# EAGLE schematic infolight (EAGLE 7.6.0)

## Sheet 1 of 4
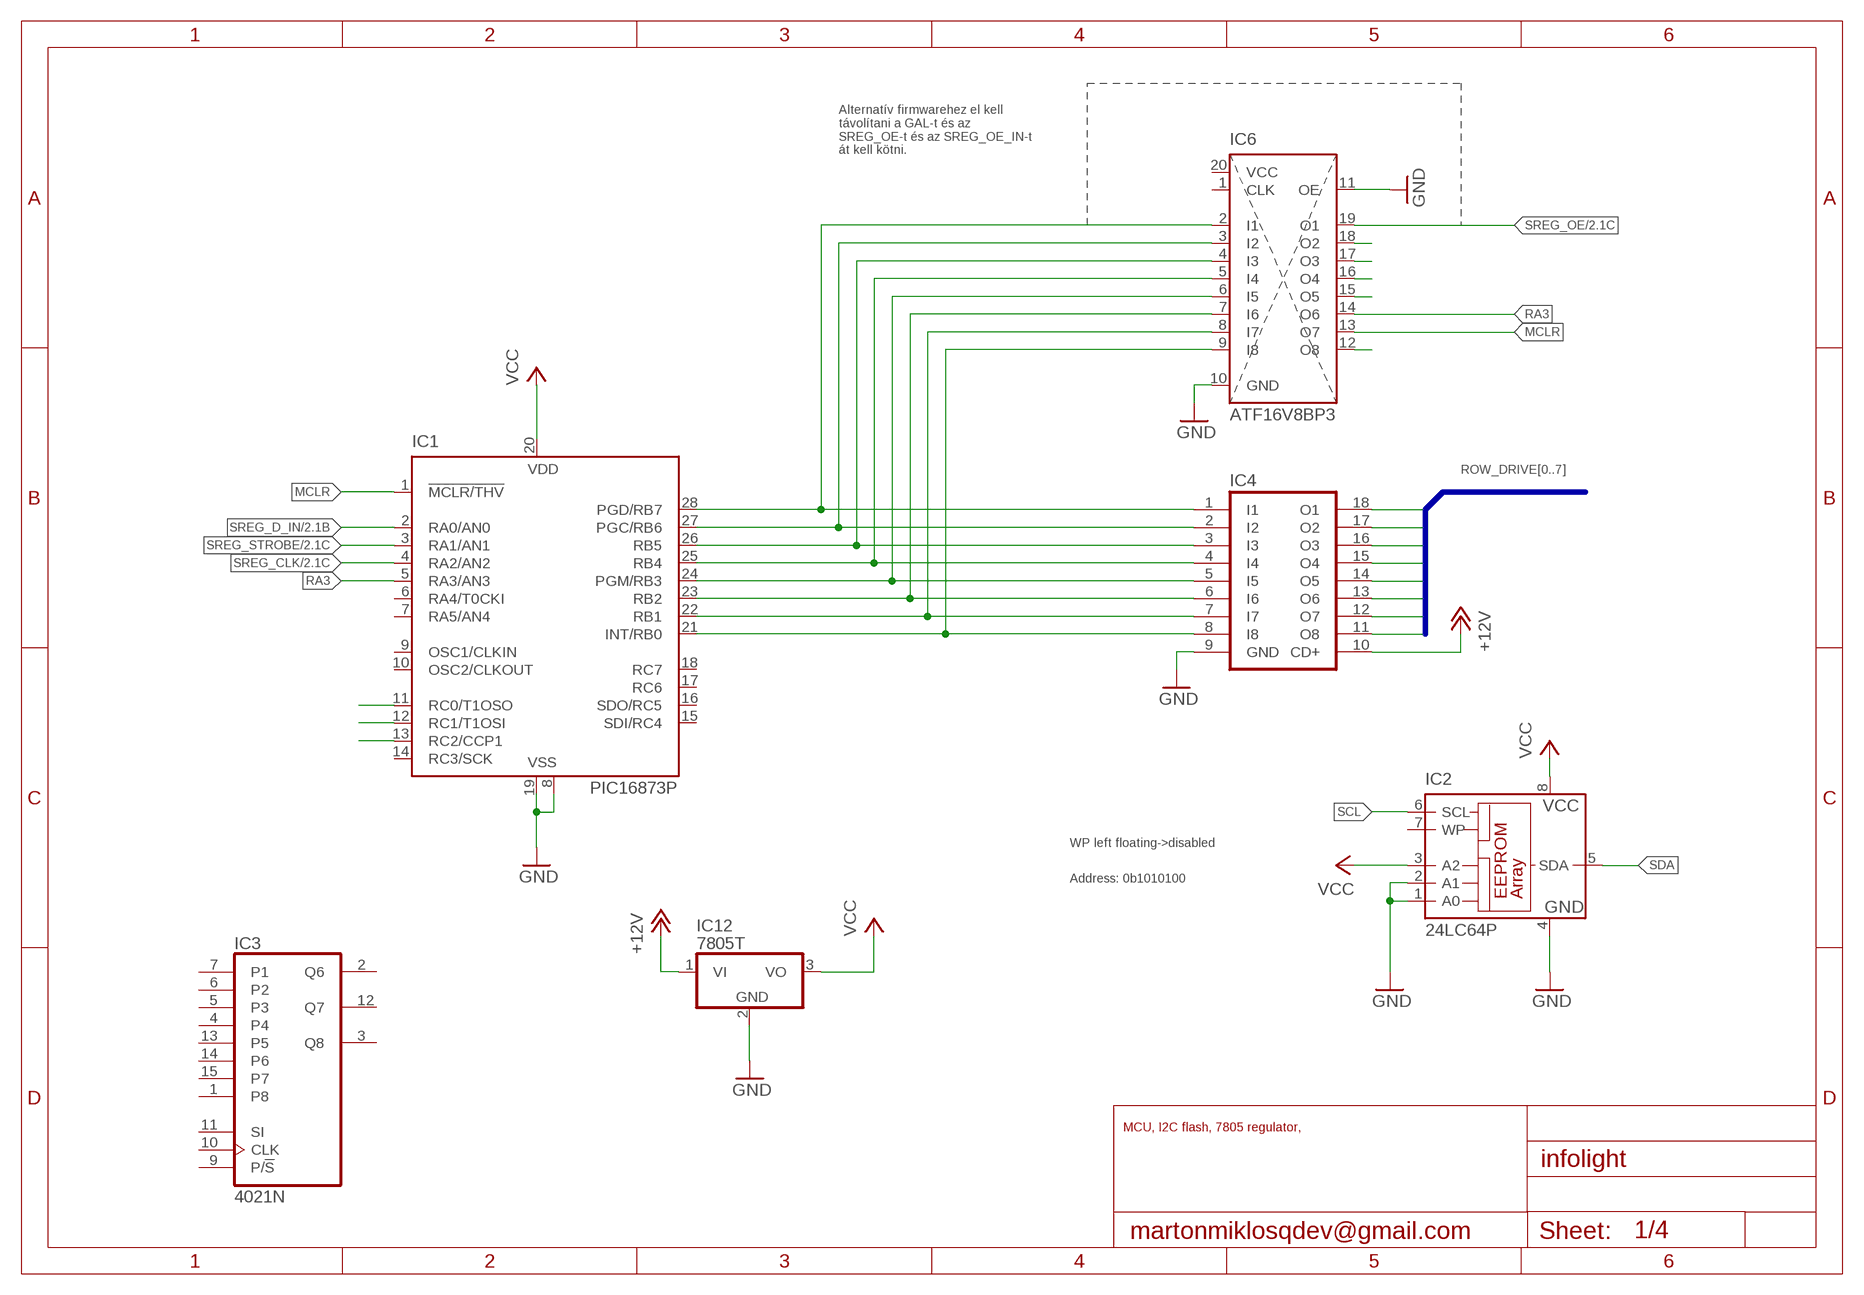
[diagram p0: schematic, sheet 1]

### Parts
IC1  PIC16873P  [DIL28-3]
IC2  24LC64P  [DIL8]
IC3  4021N  [DIL16]
IC4  ULN2804A  [DIL18]
IC6  ATF16V8BP3  [DIL20]
IC12  7805T  [TO220H]

### Nets
+12V: IC4.10(CD+) IC12.1(VI)
GND: IC1.8(VSS) IC1.19(VSS) IC2.1(A0) IC2.2(A1) IC2.4(GND) IC4.9(GND) IC6.10(GND) IC6.11(OE) IC12.2(GND) ; also sheet 2,3
MCLR: IC1.1(!MCLR/THV) IC6.13(O7)
N$18: IC6.18(O2)
N$20: IC1.13(RC2/CCP1)
N$21: IC6.17(O3)
N$22: IC1.27(PGC/RB6) IC4.2(I2) IC6.3(I2)
N$23: IC1.26(RB5) IC4.3(I3) IC6.4(I3)
N$24: IC1.25(RB4) IC4.4(I4) IC6.5(I4)
N$25: IC1.24(PGM/RB3) IC4.5(I5) IC6.6(I5)
N$26: IC1.23(RB2) IC4.6(I6) IC6.7(I6)
N$27: IC1.22(RB1) IC4.7(I7) IC6.8(I7)
N$28: IC1.21(INT/RB0) IC4.8(I8) IC6.9(I8)
N$29: IC6.12(O8)
N$30: IC6.15(O5)
N$32: IC6.16(O4)
N$84: IC1.12(RC1/T1OSI)
N$85: IC1.11(RC0/T1OSO)
RA3: IC1.5(RA3/AN3) IC6.14(O6)
ROW_DR_0: IC1.28(PGD/RB7) IC4.1(I1) IC6.2(I1)
ROW_DRIVE0: IC4.18(O1) ; also sheet 4
ROW_DRIVE1: IC4.17(O2) ; also sheet 4
ROW_DRIVE2: IC4.16(O3) ; also sheet 4
ROW_DRIVE3: IC4.15(O4) ; also sheet 4
ROW_DRIVE4: IC4.14(O5) ; also sheet 4
ROW_DRIVE5: IC4.13(O6) ; also sheet 4
ROW_DRIVE6: IC4.12(O7) ; also sheet 4
ROW_DRIVE7: IC4.11(O8) ; also sheet 4
SCL: IC2.6(SCL)
SDA: IC2.5(SDA)
SREG_CLK: IC1.4(RA2/AN2) ; also sheet 2,3
SREG_D_IN: IC1.2(RA0/AN0) ; also sheet 2
SREG_OE: IC6.19(O1) ; also sheet 2,3
SREG_STROBE: IC1.3(RA1/AN1) ; also sheet 2,3
VCC: IC1.20(VDD) IC2.3(A2) IC2.8(VCC) IC12.3(VO)
Unconnected: IC1.6(RA4/T0CKI) IC1.7(RA5/AN4) IC1.9(OSC1/CLKIN) IC1.10(OSC2/CLKOUT) IC1.14(RC3/SCK) IC1.15(SDI/RC4) IC1.16(SDO/RC5) IC1.17(RC6) IC1.18(RC7) IC2.7(WP) IC3.1(P8) IC3.2(Q6) IC3.3(Q8) IC3.4 IC3.5(P3) IC3.6(P2) IC3.7(P1) IC3.9(P/!S) IC3.10(CLK) IC3.11(SI) IC3.12(Q7) IC3.13(P5) IC3.14(P6) IC3.15(P7) IC6.1(CLK)

### Buses
ROW_DRIVE[0..7]

### Notes on the sheet
- Alternatív firmwarehez el kell
  távolítani a GAL-t és az 
  SREG_OE-t és az SREG_OE_IN-t
  át kell kötni.
- WP left floating->disabled
- Address: 0b1010100
- MCU, I2C flash, 7805 regulator,

## Sheet 2 of 4
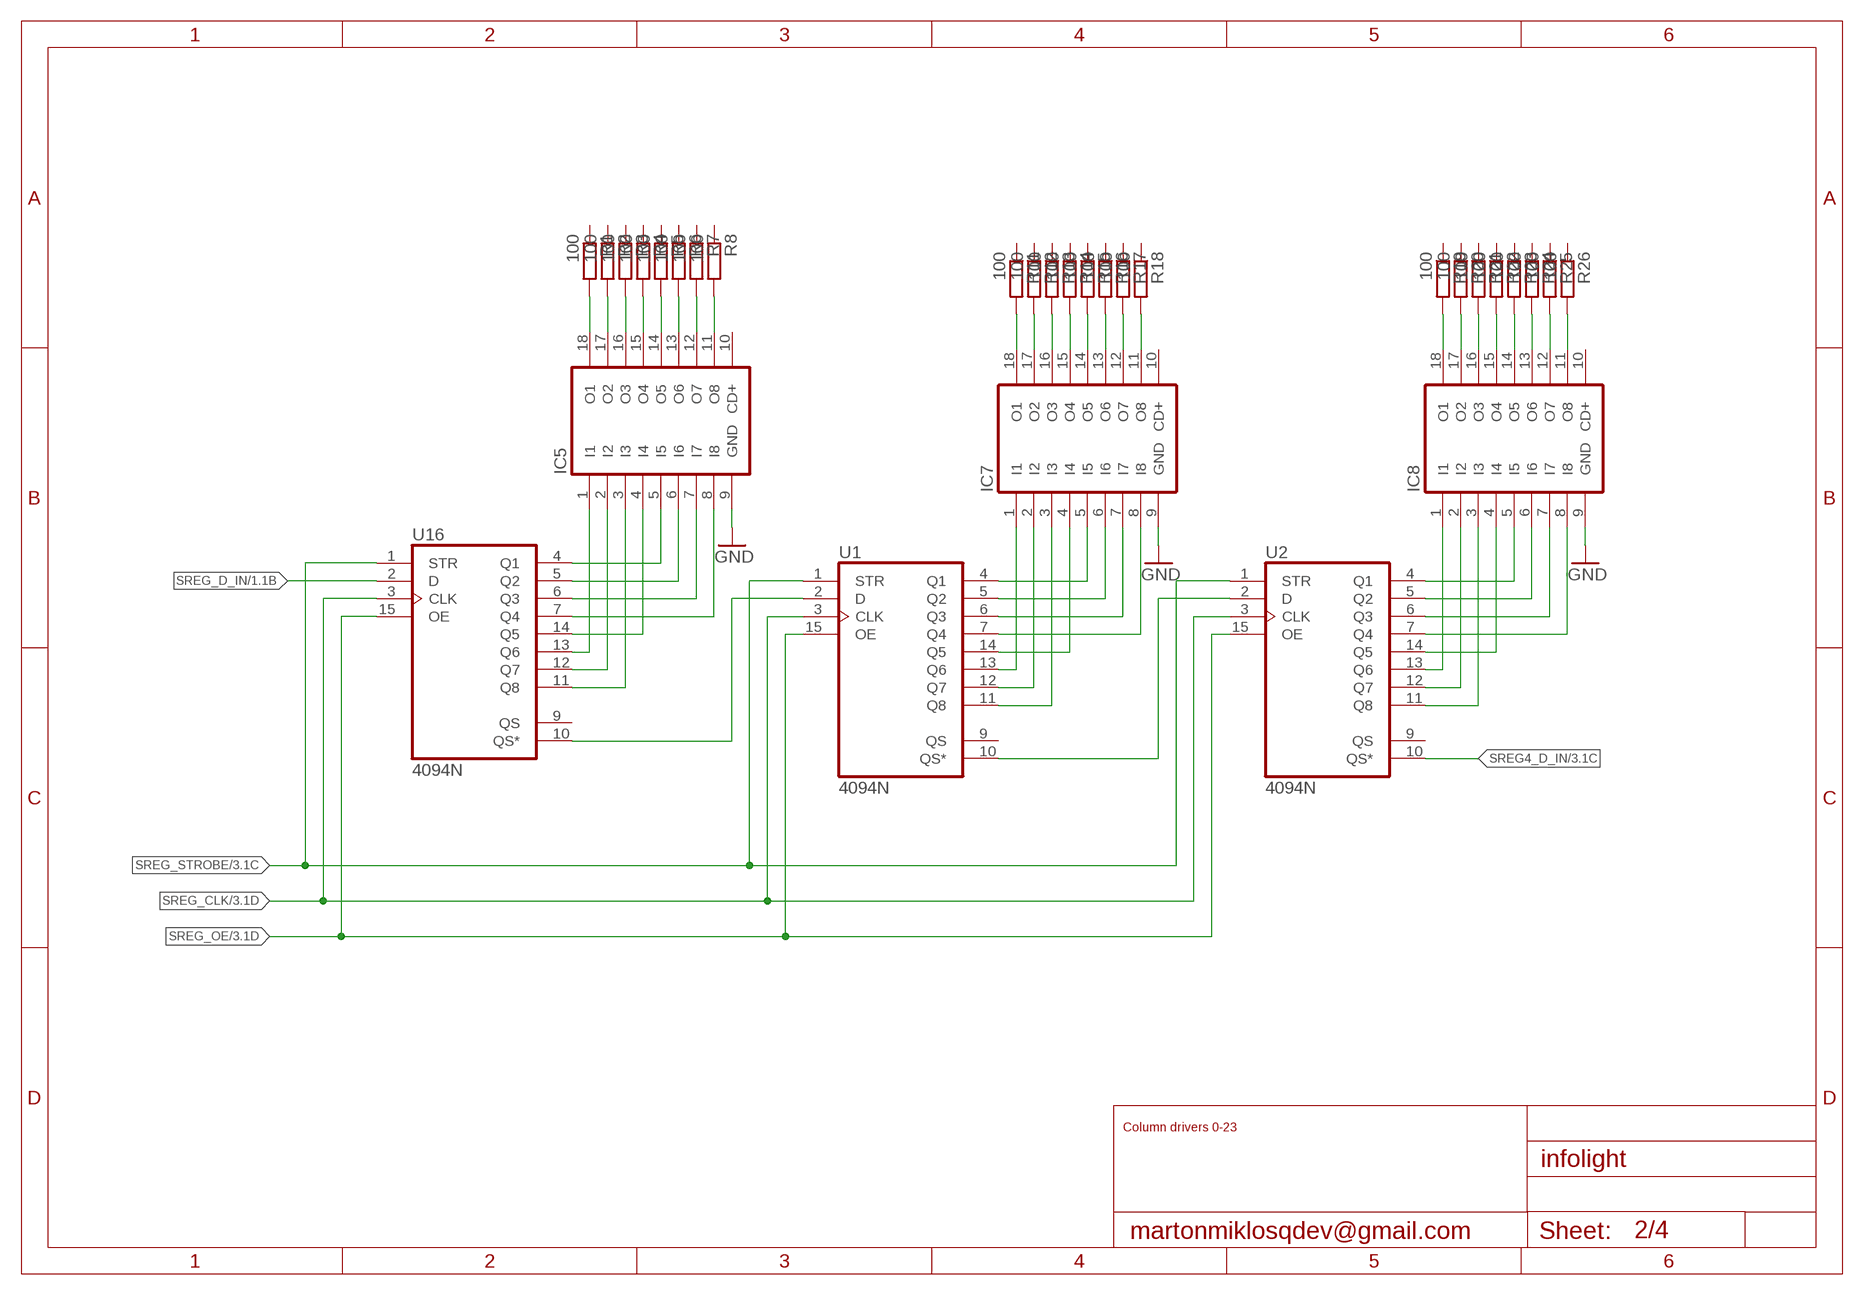
[diagram p1: schematic, sheet 2]

### Parts
IC5  ULN2804A  [DIL18]
IC7  ULN2804A  [DIL18]
IC8  ULN2804A  [DIL18]
R1  100  R-EU_0207/7  [0207/7]
R2  100  R-EU_0207/7  [0207/7]
R3  100  R-EU_0207/7  [0207/7]
R4  100  R-EU_0207/7  [0207/7]
R5  100  R-EU_0207/7  [0207/7]
R6  100  R-EU_0207/7  [0207/7]
R7  100  R-EU_0207/7  [0207/7]
R8  100  R-EU_0207/7  [0207/7]
R11  100  R-EU_0207/7  [0207/7]
R12  100  R-EU_0207/7  [0207/7]
R13  100  R-EU_0207/7  [0207/7]
R14  100  R-EU_0207/7  [0207/7]
R15  100  R-EU_0207/7  [0207/7]
R16  100  R-EU_0207/7  [0207/7]
R17  100  R-EU_0207/7  [0207/7]
R18  100  R-EU_0207/7  [0207/7]
R19  100  R-EU_0207/7  [0207/7]
R20  100  R-EU_0207/7  [0207/7]
R21  100  R-EU_0207/7  [0207/7]
R22  100  R-EU_0207/7  [0207/7]
R23  100  R-EU_0207/7  [0207/7]
R24  100  R-EU_0207/7  [0207/7]
R25  100  R-EU_0207/7  [0207/7]
R26  100  R-EU_0207/7  [0207/7]
U1  4094N  [DIL16]
U2  4094N  [DIL16]
U16  4094N  [DIL16]

### Nets
GND: IC5.9(GND) IC7.9(GND) IC8.9(GND) ; also sheet 1,3
N$1: IC5.5(I5) U16.4(Q1)
N$2: IC5.6(I6) U16.5(Q2)
N$3: IC5.7(I7) U16.6(Q3)
N$4: IC5.8(I8) U16.7(Q4)
N$5: IC5.4(I4) U16.14(Q5)
N$6: IC5.1(I1) U16.13(Q6)
N$7: IC5.3(I3) U16.11(Q8)
N$8: IC5.2(I2) U16.12(Q7)
N$9: IC5.18(O1) R1.2
N$10: IC5.17(O2) R2.2
N$11: IC5.16(O3) R3.2
N$12: IC5.15(O4) R4.2
N$13: IC5.14(O5) R5.2
N$14: IC5.13(O6) R6.2
N$15: IC5.12(O7) R7.2
N$16: IC5.11(O8) R8.2
N$31: IC7.5(I5) U1.4(Q1)
N$33: IC7.6(I6) U1.5(Q2)
N$34: IC7.7(I7) U1.6(Q3)
N$35: IC7.8(I8) U1.7(Q4)
N$36: IC7.4(I4) U1.14(Q5)
N$37: IC7.1(I1) U1.13(Q6)
N$38: IC7.3(I3) U1.11(Q8)
N$39: IC7.2(I2) U1.12(Q7)
N$40: IC7.18(O1) R11.2
N$41: IC7.17(O2) R12.2
N$42: IC7.16(O3) R13.2
N$43: IC7.15(O4) R14.2
N$44: IC7.14(O5) R15.2
N$45: IC7.13(O6) R16.2
N$46: IC7.12(O7) R17.2
N$47: IC7.11(O8) R18.2
N$48: U1.2(D)
N$49: U16.10(QS*)
N$50: IC8.5(I5) U2.4(Q1)
N$51: IC8.6(I6) U2.5(Q2)
N$52: IC8.7(I7) U2.6(Q3)
N$53: IC8.8(I8) U2.7(Q4)
N$54: IC8.4(I4) U2.14(Q5)
N$55: IC8.1(I1) U2.13(Q6)
N$56: IC8.3(I3) U2.11(Q8)
N$57: IC8.2(I2) U2.12(Q7)
N$58: IC8.18(O1) R19.2
N$59: IC8.17(O2) R20.2
N$60: IC8.16(O3) R21.2
N$61: IC8.15(O4) R22.2
N$62: IC8.14(O5) R23.2
N$63: IC8.13(O6) R24.2
N$64: IC8.12(O7) R25.2
N$65: IC8.11(O8) R26.2
N$66: U2.2(D)
N$67: U1.10(QS*)
SREG4_D_IN: U2.10(QS*) ; also sheet 3
SREG_CLK: U1.3(CLK) U2.3(CLK) U16.3(CLK) ; also sheet 1,3
SREG_D_IN: U16.2(D) ; also sheet 1
SREG_OE: U1.15(OE) U2.15(OE) U16.15(OE) ; also sheet 1,3
SREG_STROBE: U1.1(STR) U2.1(STR) U16.1(STR) ; also sheet 1,3
Unconnected: IC5.10(CD+) IC7.10(CD+) IC8.10(CD+) R1.1 R2.1 R3.1 R4.1 R5.1 R6.1 R7.1 R8.1 R11.1 R12.1 R13.1 R14.1 R15.1 R16.1 R17.1 R18.1 R19.1 R20.1 R21.1 R22.1 R23.1 R24.1 R25.1 R26.1 U1.9(QS) U2.9(QS) U16.9(QS)

### Notes on the sheet
- Column drivers 0-23

## Sheet 3 of 4
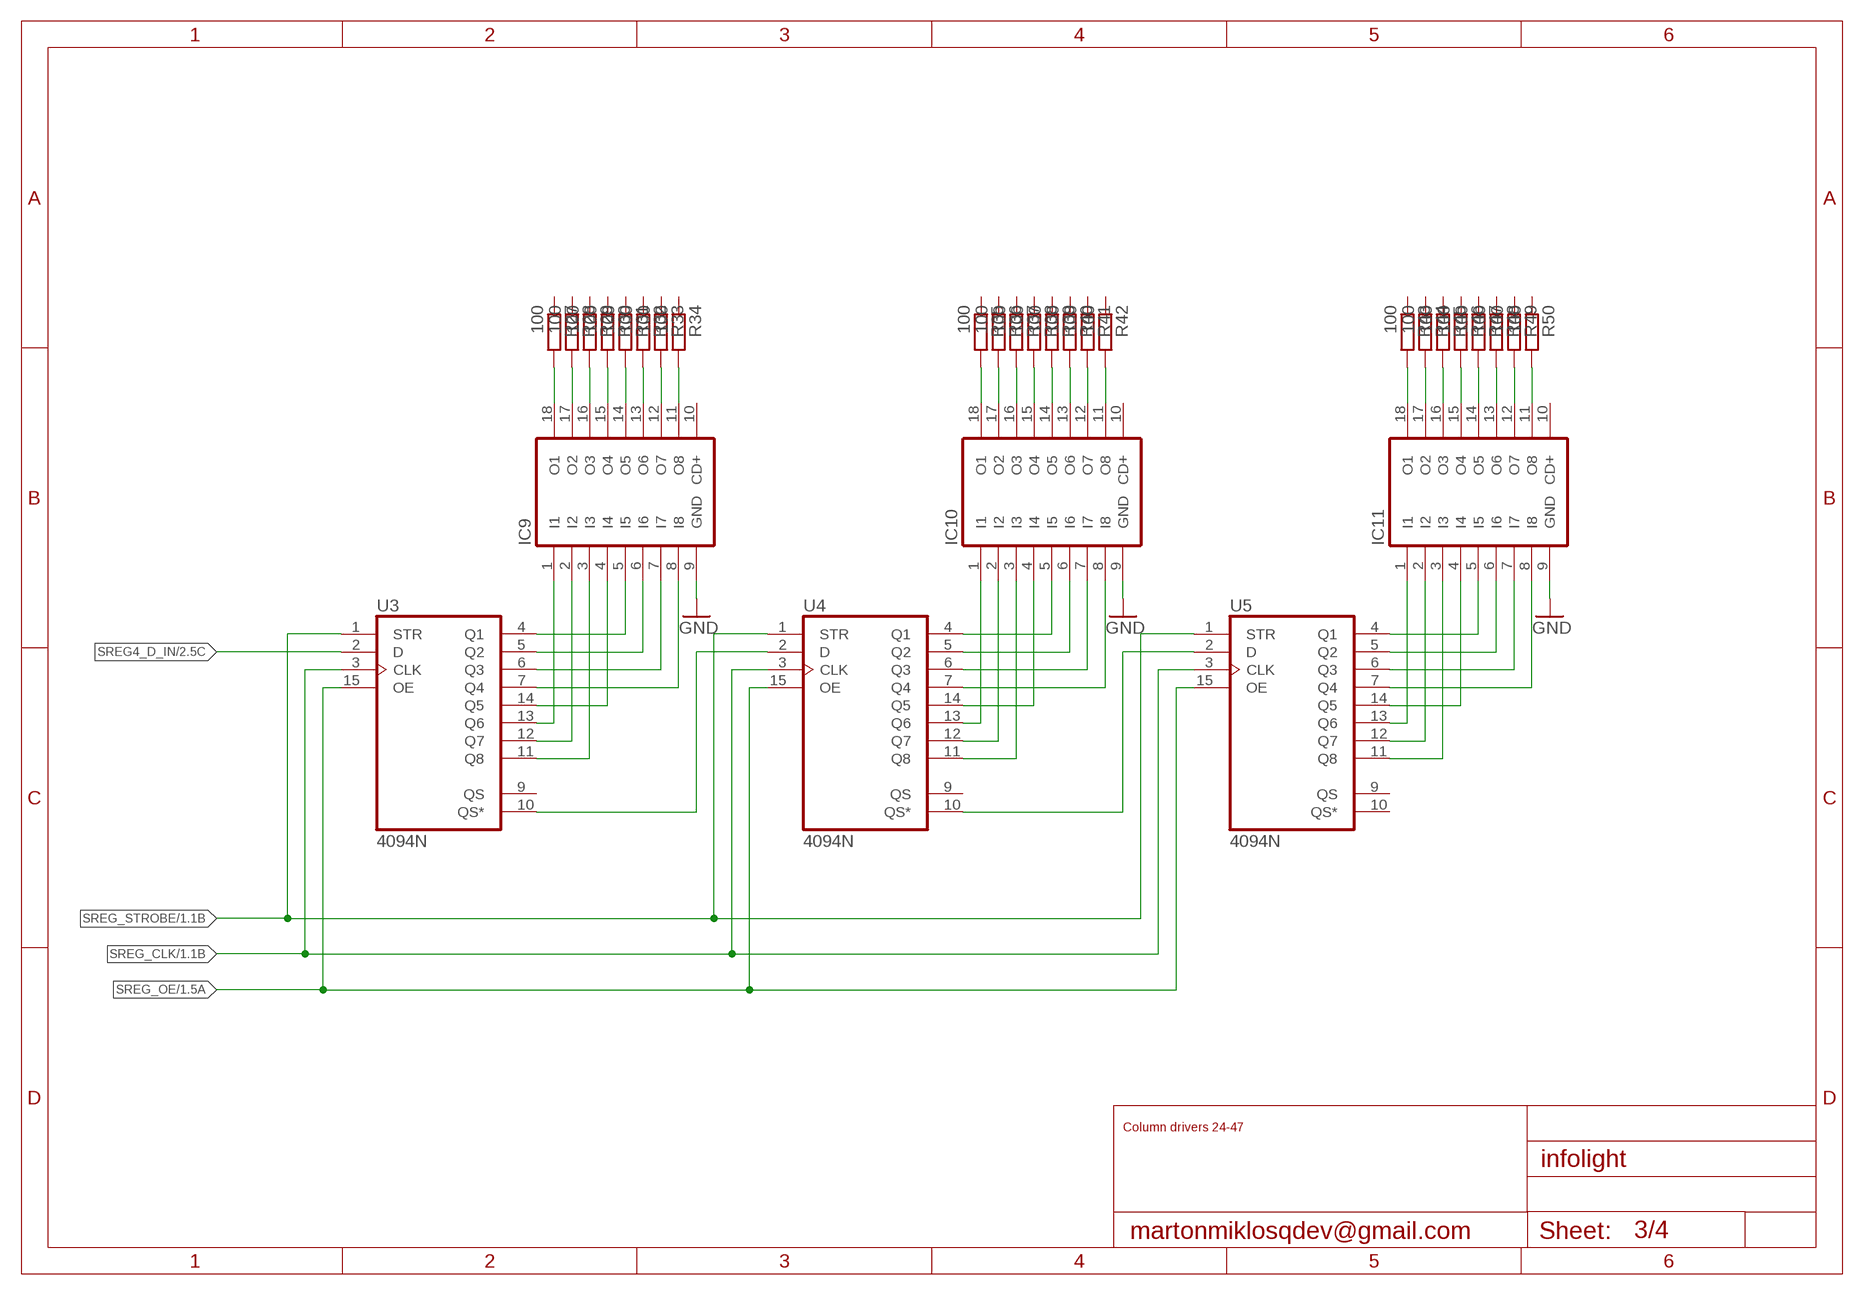
[diagram p2: schematic, sheet 3]

### Parts
IC9  ULN2804A  [DIL18]
IC10  ULN2804A  [DIL18]
IC11  ULN2804A  [DIL18]
R27  100  R-EU_0207/7  [0207/7]
R28  100  R-EU_0207/7  [0207/7]
R29  100  R-EU_0207/7  [0207/7]
R30  100  R-EU_0207/7  [0207/7]
R31  100  R-EU_0207/7  [0207/7]
R32  100  R-EU_0207/7  [0207/7]
R33  100  R-EU_0207/7  [0207/7]
R34  100  R-EU_0207/7  [0207/7]
R35  100  R-EU_0207/7  [0207/7]
R36  100  R-EU_0207/7  [0207/7]
R37  100  R-EU_0207/7  [0207/7]
R38  100  R-EU_0207/7  [0207/7]
R39  100  R-EU_0207/7  [0207/7]
R40  100  R-EU_0207/7  [0207/7]
R41  100  R-EU_0207/7  [0207/7]
R42  100  R-EU_0207/7  [0207/7]
R43  100  R-EU_0207/7  [0207/7]
R44  100  R-EU_0207/7  [0207/7]
R45  100  R-EU_0207/7  [0207/7]
R46  100  R-EU_0207/7  [0207/7]
R47  100  R-EU_0207/7  [0207/7]
R48  100  R-EU_0207/7  [0207/7]
R49  100  R-EU_0207/7  [0207/7]
R50  100  R-EU_0207/7  [0207/7]
U3  4094N  [DIL16]
U4  4094N  [DIL16]
U5  4094N  [DIL16]

### Nets
GND: IC9.9(GND) IC10.9(GND) IC11.9(GND) ; also sheet 1,2
N$68: IC9.5(I5) U3.4(Q1)
N$69: IC9.6(I6) U3.5(Q2)
N$70: IC9.7(I7) U3.6(Q3)
N$71: IC9.8(I8) U3.7(Q4)
N$72: IC9.4(I4) U3.14(Q5)
N$73: IC9.1(I1) U3.13(Q6)
N$74: IC9.3(I3) U3.11(Q8)
N$75: IC9.2(I2) U3.12(Q7)
N$76: IC9.18(O1) R27.2
N$77: IC9.17(O2) R28.2
N$78: IC9.16(O3) R29.2
N$79: IC9.15(O4) R30.2
N$80: IC9.14(O5) R31.2
N$81: IC9.13(O6) R32.2
N$82: IC9.12(O7) R33.2
N$83: IC9.11(O8) R34.2
N$86: IC10.5(I5) U4.4(Q1)
N$87: IC10.6(I6) U4.5(Q2)
N$88: IC10.7(I7) U4.6(Q3)
N$89: IC10.8(I8) U4.7(Q4)
N$90: IC10.4(I4) U4.14(Q5)
N$91: IC10.1(I1) U4.13(Q6)
N$92: IC10.3(I3) U4.11(Q8)
N$93: IC10.2(I2) U4.12(Q7)
N$94: IC10.18(O1) R35.2
N$95: IC10.17(O2) R36.2
N$96: IC10.16(O3) R37.2
N$97: IC10.15(O4) R38.2
N$98: IC10.14(O5) R39.2
N$99: IC10.13(O6) R40.2
N$100: IC10.12(O7) R41.2
N$101: IC10.11(O8) R42.2
N$102: U4.2(D)
N$103: U3.10(QS*)
N$104: IC11.5(I5) U5.4(Q1)
N$105: IC11.6(I6) U5.5(Q2)
N$106: IC11.7(I7) U5.6(Q3)
N$107: IC11.8(I8) U5.7(Q4)
N$108: IC11.4(I4) U5.14(Q5)
N$109: IC11.1(I1) U5.13(Q6)
N$110: IC11.3(I3) U5.11(Q8)
N$111: IC11.2(I2) U5.12(Q7)
N$112: IC11.18(O1) R43.2
N$113: IC11.17(O2) R44.2
N$114: IC11.16(O3) R45.2
N$115: IC11.15(O4) R46.2
N$116: IC11.14(O5) R47.2
N$117: IC11.13(O6) R48.2
N$118: IC11.12(O7) R49.2
N$119: IC11.11(O8) R50.2
N$120: U5.2(D)
N$121: U4.10(QS*)
SREG4_D_IN: U3.2(D) ; also sheet 2
SREG_CLK: U3.3(CLK) U4.3(CLK) U5.3(CLK) ; also sheet 1,2
SREG_OE: U3.15(OE) U4.15(OE) U5.15(OE) ; also sheet 1,2
SREG_STROBE: U3.1(STR) U4.1(STR) U5.1(STR) ; also sheet 1,2
Unconnected: IC9.10(CD+) IC10.10(CD+) IC11.10(CD+) R27.1 R28.1 R29.1 R30.1 R31.1 R32.1 R33.1 R34.1 R35.1 R36.1 R37.1 R38.1 R39.1 R40.1 R41.1 R42.1 R43.1 R44.1 R45.1 R46.1 R47.1 R48.1 R49.1 R50.1 U3.9(QS) U4.9(QS) U5.9(QS) U5.10(QS*)

### Notes on the sheet
- Column drivers 24-47

## Sheet 4 of 4
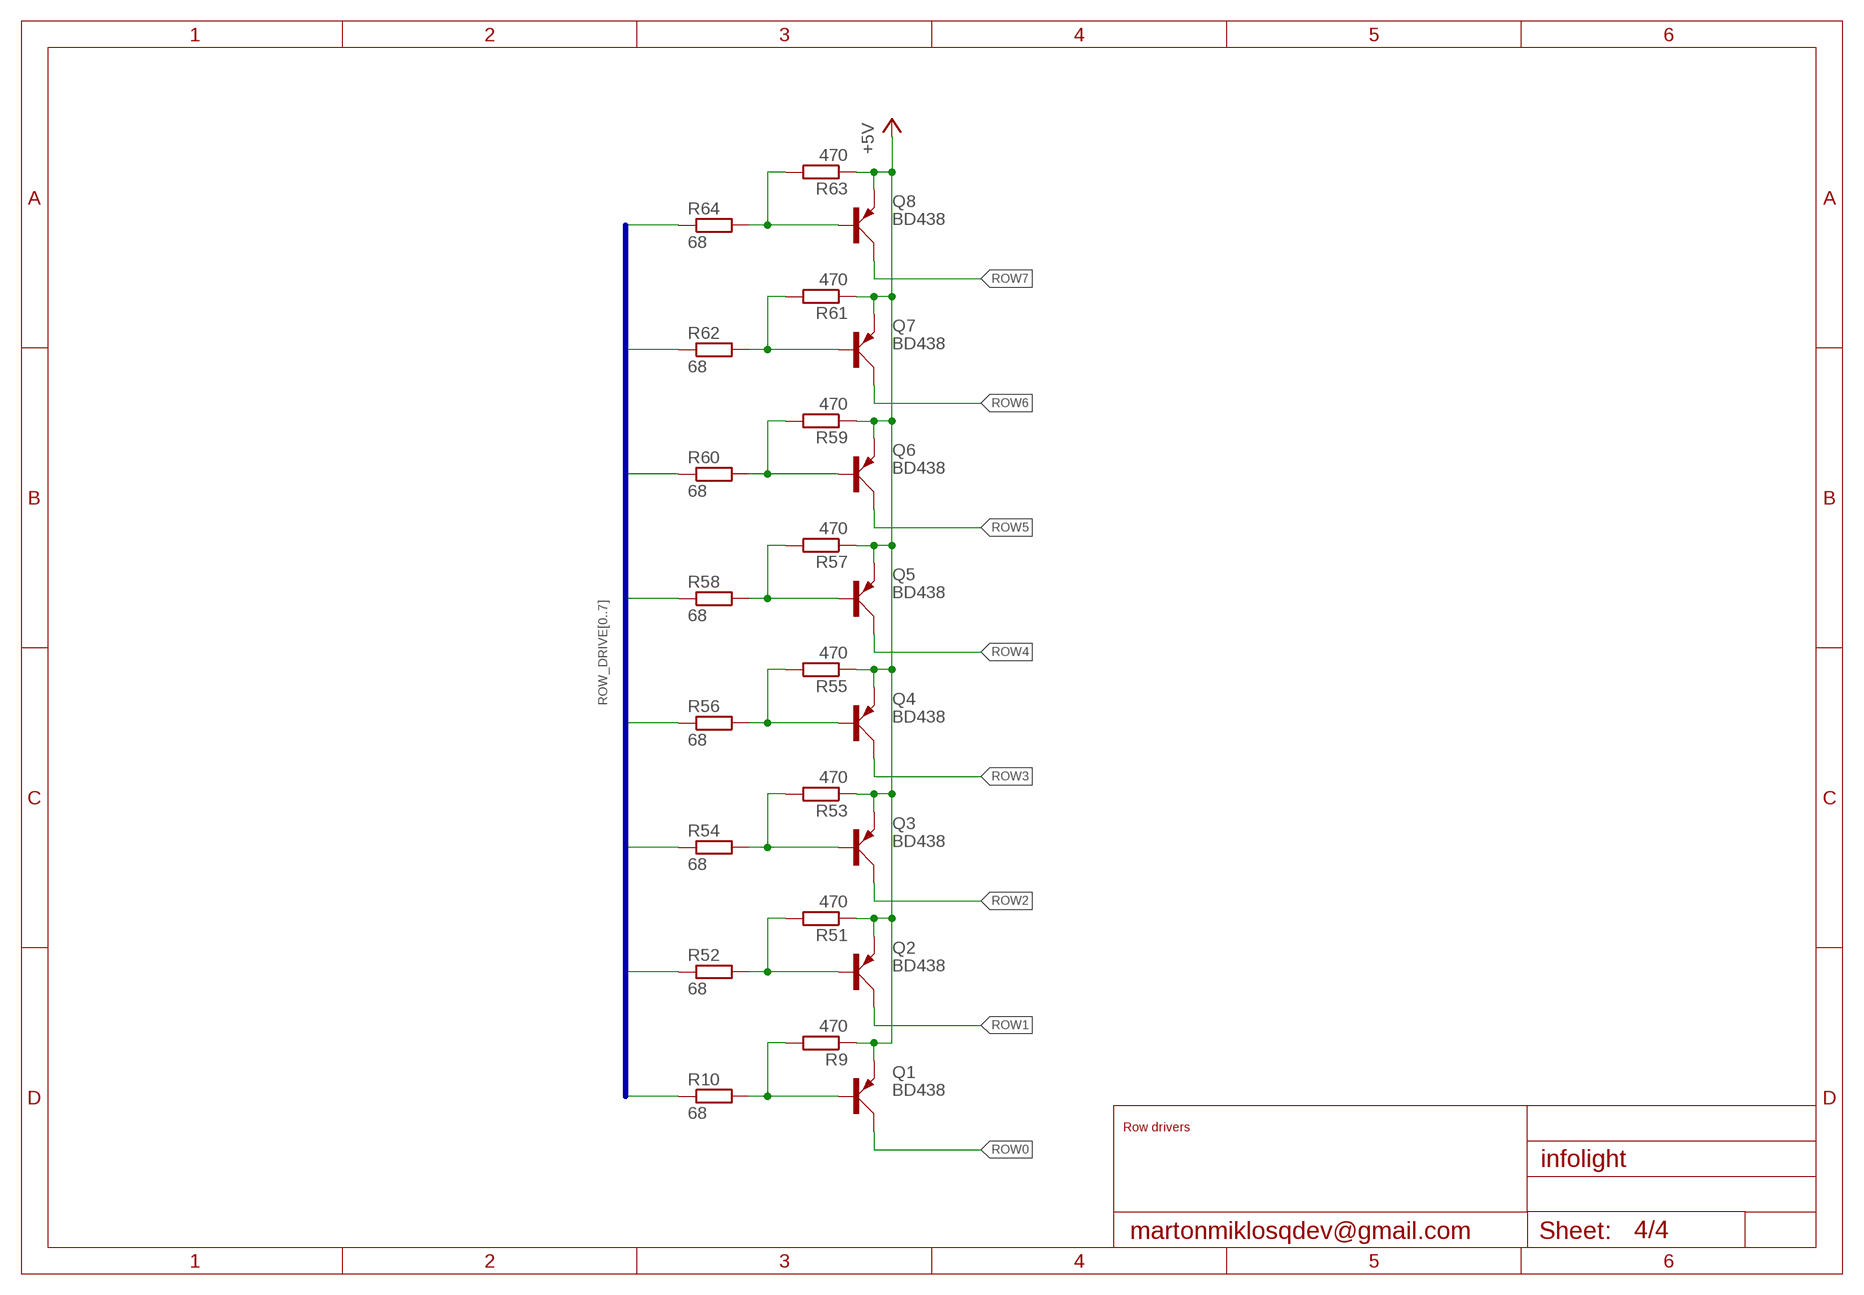
[diagram p3: schematic, sheet 4]

### Parts
Q1  BD438  [TO126AV]
Q2  BD438  [TO126AV]
Q3  BD438  [TO126AV]
Q4  BD438  [TO126AV]
Q5  BD438  [TO126AV]
Q6  BD438  [TO126AV]
Q7  BD438  [TO126AV]
Q8  BD438  [TO126AV]
R9  470  R-EU_0207/7  [0207/7]
R10  68  R-EU_0207/7  [0207/7]
R51  470  R-EU_0207/7  [0207/7]
R52  68  R-EU_0207/7  [0207/7]
R53  470  R-EU_0207/7  [0207/7]
R54  68  R-EU_0207/7  [0207/7]
R55  470  R-EU_0207/7  [0207/7]
R56  68  R-EU_0207/7  [0207/7]
R57  470  R-EU_0207/7  [0207/7]
R58  68  R-EU_0207/7  [0207/7]
R59  470  R-EU_0207/7  [0207/7]
R60  68  R-EU_0207/7  [0207/7]
R61  470  R-EU_0207/7  [0207/7]
R62  68  R-EU_0207/7  [0207/7]
R63  470  R-EU_0207/7  [0207/7]
R64  68  R-EU_0207/7  [0207/7]

### Nets
+5V: Q1.E Q2.E Q3.E Q4.E Q5.E Q6.E Q7.E Q8.E R9.1 R51.1 R53.1 R55.1 R57.1 R59.1 R61.1 R63.1
N$17: Q1.B R9.2 R10.2
N$19: Q2.B R51.2 R52.2
N$125: Q3.B R53.2 R54.2
N$127: Q4.B R55.2 R56.2
N$131: Q5.B R57.2 R58.2
N$133: Q6.B R59.2 R60.2
N$137: Q7.B R61.2 R62.2
N$139: Q8.B R63.2 R64.2
ROW0: Q1.C
ROW1: Q2.C
ROW2: Q3.C
ROW3: Q4.C
ROW4: Q5.C
ROW5: Q6.C
ROW6: Q7.C
ROW7: Q8.C
ROW_DRIVE0: R10.1 ; also sheet 1
ROW_DRIVE1: R52.1 ; also sheet 1
ROW_DRIVE2: R54.1 ; also sheet 1
ROW_DRIVE3: R56.1 ; also sheet 1
ROW_DRIVE4: R58.1 ; also sheet 1
ROW_DRIVE5: R60.1 ; also sheet 1
ROW_DRIVE6: R62.1 ; also sheet 1
ROW_DRIVE7: R64.1 ; also sheet 1

### Buses
ROW_DRIVE[0..7]

### Notes on the sheet
- Row drivers

## Power pins joined to a net without a drawn wire
VCC: IC6.20(VCC)
VDD: IC3.16(VDD) U1.16(VDD) U2.16(VDD) U3.16(VDD) U4.16(VDD) U5.16(VDD) U16.16(VDD)
VSS: IC3.8(VSS) U1.8(VSS) U2.8(VSS) U3.8(VSS) U4.8(VSS) U5.8(VSS) U16.8(VSS)

## Library data of the parts
IC1 = microchip:PIC16*873: MICROCONTROLLER flash type; OC_FARNELL: unknown; OC_NEWARK: unknown
IC2 = microchip:24*: Serial EEPROM I2C; MF: MICROCHIP; MPN: 24LC64-I/P; OC_FARNELL: 9758054; OC_NEWARK: 62K0584
IC3 = 40xx:4021: 8-bit static SHIFT REGISTER
IC4 IC5 IC7-IC11 = uln-udn:ULN2804A: DRIVER ARRAY
IC6 = atmel:ATF16V8B: High perfomance CMOS (electrically erasable) programmable logic device (PLD) ABLE-Atmel-ABEL - P18V8R, P16V8C, P16V8AS, P17V8 COPL Atmel-WinCUPL - G16V8MS, G16V8MA, G16V8AS, G16V8 LOG/IC - GAL16V8_R, GAL16V8_G7, GAL16V8_C), GAL16V8 Tango-PLD - G16V8R, G16V8C, G16V8AS, G16V8 Source: http://www.atmel.com/dyn/resources/prod_documents/DOC0364.PDF; MPN: ATF16V8CZ-15PU; OC_FARNELL: 1551768; OC_NEWARK: 94M6254
IC12 = linear:78*: Positive VOLTAGE REGULATOR Source: http://cache.national.com/ds/LM/LM78L05.pdf http://www.fairchildsemi.com/ds/LM/LM7805.pdf
Q1-Q8 = transistor-power:BD438: PNP TRANSISTOR
R1-R64 = rcl:R-EU_: RESISTOR, European symbol
U1-U5 U16 = 40xx:4094: 8-stage SHIFT/STORE REGISTER, tri-state